# EAGLE board maho-dio (EAGLE 4.16)
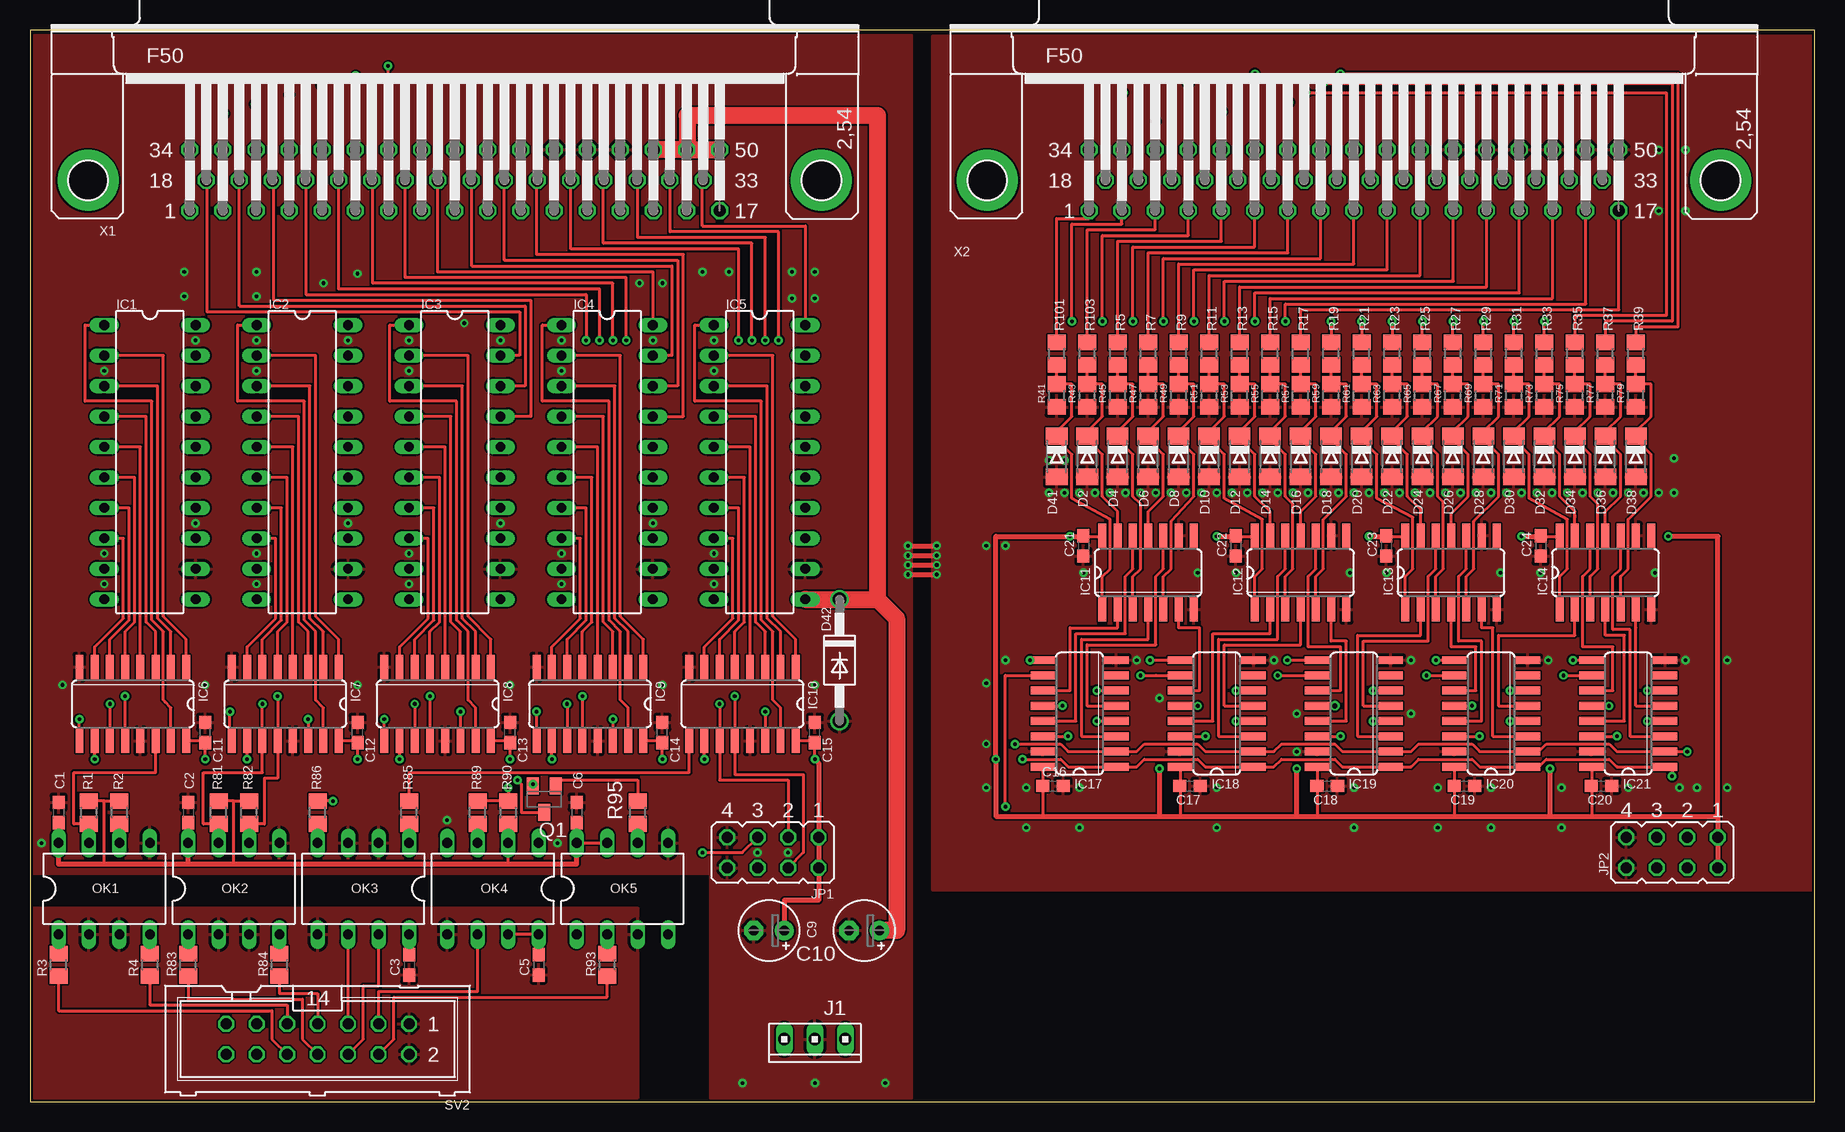
[diagram p2: board, top side]
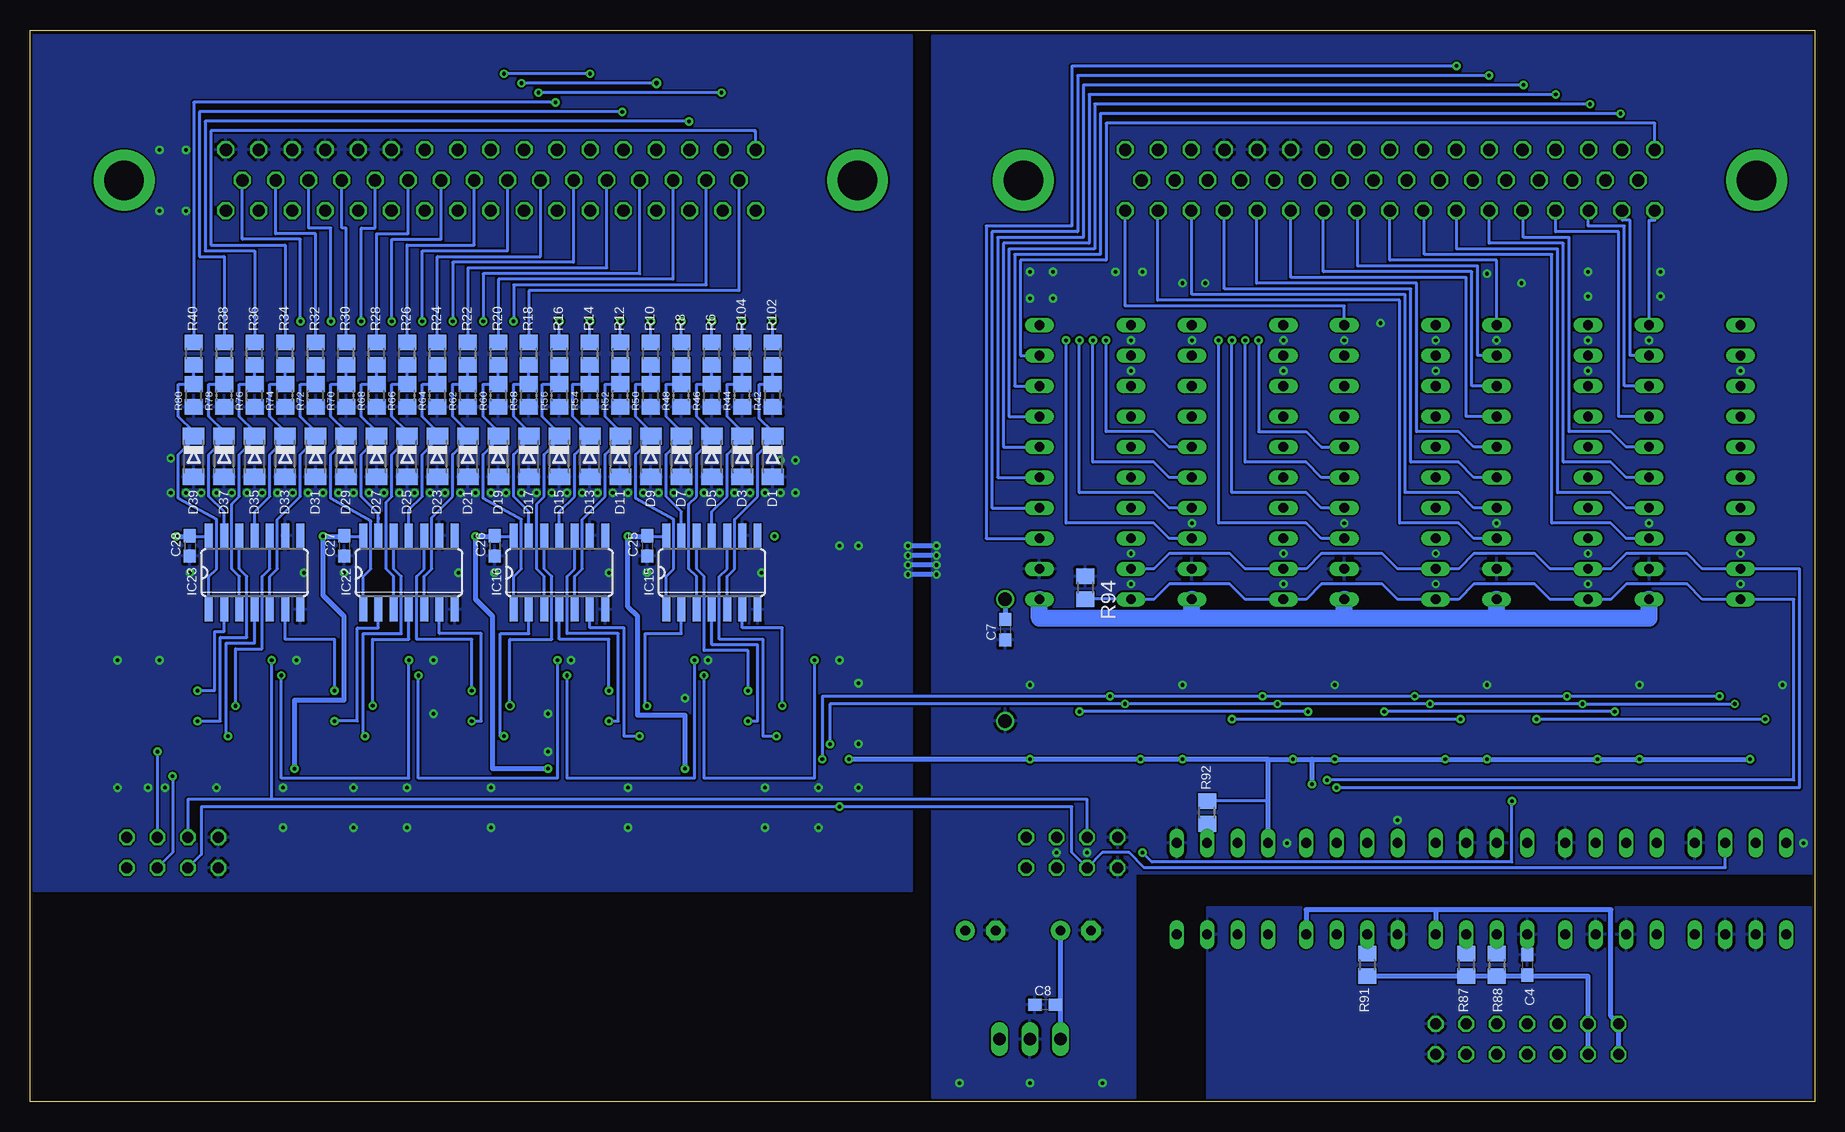
[diagram p3: board, bottom side, seen from below]

Size 148.73 x 89.36 mm. Coordinates in mm from the lower left corner, seen from the top.
Outline: 0,0 148.73,0 148.73,89.36 0,89.36 0,0
Copper layers (1+2*15+16): Top 0.035mm / dielectric 0.15mm / Route2 0.018mm / dielectric 1.5mm / Route15 0.018mm / dielectric 0.15mm / Bottom 0.035mm
Design rules "eurocircuits_class5": minimum track width 0.15mm, minimum drill 0.2mm, track to track 0.15mm, track to pad 0.15mm, pad to pad 0.15mm, via to via 0.15mm, smd to smd 0mil, copper to edge 0.2mm, drill to drill 0.2mm, minimum pad ring 0.2mm, minimum via ring 0.2mm, stop-mask expansion 4mil, vias tented up to drill 0mil, thermal gap 10mil

## Footprints (pad centres in the part's own frame; a part is rotated, then mirrored left to right if it is on the bottom)
C0603 = smd 1.1 x 1: 1 -0.85,0; 2 0.85,0
E2,5-5 = drill 0.813 pad 1.6 round: + -1.27,0 | drill 0.813 pad 1.6 octagon: - 1.27,0
MINIMELF = smd 1.4 x 1.8: A 1.7,0; C -1.7,0
DO41-10 = drill 1.118 round: A 5.08,0; C -5.08,0
DIL20 = drill 0.813 long: 1 -11.43,-3.81; 2 -8.89,-3.81; 3 -6.35,-3.81; 4 -3.81,-3.81; 5 -1.27,-3.81; 6 1.27,-3.81; 7 3.81,-3.81; 8 6.35,-3.81; 9 8.89,-3.81; 10 11.43,-3.81; 11 11.43,3.81; 12 8.89,3.81; 13 6.35,3.81; 14 3.81,3.81; 15 1.27,3.81; 16 -1.27,3.81; 17 -3.81,3.81; 18 -6.35,3.81; 19 -8.89,3.81; 20 -11.43,3.81
SO16 = smd 0.66 x 2.032: 1 -4.445,-3.073; 2 -3.175,-3.073; 3 -1.905,-3.073; 4 -0.635,-3.073; 5 0.635,-3.073; 6 1.905,-3.073; 7 3.175,-3.073; 8 4.445,-3.073; 9 4.445,3.073; 10 3.175,3.073; 11 1.905,3.073; 12 0.635,3.073; 13 -0.635,3.073; 14 -1.905,3.073; 15 -3.175,3.073; 16 -4.445,3.073
SO14 = smd 0.66 x 2.032: 1 -3.81,-3.073; 2 -2.54,-3.073; 3 -1.27,-3.073; 4 0,-3.073; 5 1.27,-3.073; 6 2.54,-3.073; 7 3.81,-3.073; 8 3.81,3.073; 9 2.54,3.073; 10 1.27,3.073; 11 0,3.073; 12 -1.27,3.073; 13 -2.54,3.073; 14 -3.81,3.073
10X03MTA = drill 1.016 long: 1 2.54,0; 2 0,0; 3 -2.54,0
JP4Q = drill 0.914 octagon: 1 -3.81,-1.27; 2 -3.81,1.27; 3 -1.27,-1.27; 4 -1.27,1.27; 5 1.27,-1.27; 6 1.27,1.27; 7 3.81,-1.27; 8 3.81,1.27
DIL08 = drill 0.813 long: 1 -3.81,-3.81; 2 -1.27,-3.81; 3 1.27,-3.81; 4 3.81,-3.81; 5 3.81,3.81; 6 1.27,3.81; 7 -1.27,3.81; 8 -3.81,3.81
SOT23-BEC = smd 1 x 1.4: B -0.95,-1.1; C 0,1.1; E 0.95,-1.1
R0805 = smd 1.3 x 1.5: 1 -0.95,0; 2 0.95,0
ML14 = drill 0.914 octagon: 1 -7.62,-1.27; 2 -7.62,1.27; 3 -5.08,-1.27; 4 -5.08,1.27; 5 -2.54,-1.27; 6 -2.54,1.27; 7 0,-1.27; 8 0,1.27; 9 2.54,-1.27; 10 2.54,1.27; 11 5.08,-1.27; 12 5.08,1.27; 13 7.62,-1.27; 14 7.62,1.27
F50HP = drill 1.016 octagon: 1 -22.073,-2.54; 2 -19.329,-2.54; 3 -16.561,-2.54; 4 -13.792,-2.54; 5 -11.049,-2.54; 6 -8.28,-2.54; 7 -5.512,-2.54; 8 -2.769,-2.54; 9 0,-2.54; 10 2.769,-2.54; 11 5.512,-2.54; 12 8.28,-2.54; 13 11.049,-2.54; 14 13.792,-2.54; 15 16.561,-2.54; 16 19.329,-2.54; 17 22.073,-2.54; 18 -20.701,0; 19 -17.958,0; 20 -15.189,0; 21 -12.421,0; 22 -9.677,0; 23 -6.909,0; 24 -4.14,0; 25 -1.397,0; 26 1.372,0; 27 4.14,0; 28 6.883,0; 29 9.652,0; 30 12.421,0; 31 15.189,0; 32 17.932,0; 33 20.701,0; 34 -22.073,2.54; 35 -19.329,2.54; 36 -16.561,2.54; 37 -13.792,2.54; 38 -11.049,2.54; 39 -8.28,2.54; 40 -5.512,2.54; 41 -2.769,2.54; 42 0,2.54; 43 2.769,2.54; 44 5.512,2.54; 45 8.28,2.54; 46 11.049,2.54; 47 13.792,2.54; 48 16.561,2.54; 49 19.329,2.54; 50 22.073,2.54 | drill 3.302 pad 5.08 round: G1 -30.556,0; G2 30.556,0

## Placement (x,y rotation side)
C1  100n  [C0603]  2.38,24.12 270 top
C2  100n  [C0603]  13.17,24.12 270 top
C3  100n  [C0603]  31.59,11.42 270 top
C4  100n  [C0603]  23.97,11.42 270 bottom
C5  100n  [C0603]  42.38,11.42 270 top
C6  100n  [C0603]  45.56,24.12 270 top
C7  100n  [C0603]  67.46,39.36 270 bottom
C8  100n  [C0603]  64.13,8.09 180 bottom
C9  4u7/50V  [E2,5-5]  61.59,14.28 180 top
C10  10u/50V  [E2,5-5]  69.53,14.28 180 top
C11  100n  [C0603]  14.6,30.79 90 top
C12  100n  [C0603]  27.3,30.79 90 top
C13  100n  [C0603]  40,30.79 90 top
C14  100n  [C0603]  52.7,30.79 90 top
C15  100n  [C0603]  65.4,30.79 90 top
C16  100n  [C0603]  85.24,26.35 0 top
C17  100n  [C0603]  96.67,26.35 0 top
C18  100n  [C0603]  108.1,26.35 0 top
C19  100n  [C0603]  119.53,26.35 0 top
C20  100n  [C0603]  130.96,26.35 0 top
C21  100n  [C0603]  87.78,46.35 270 top
C22  100n  [C0603]  100.48,46.35 270 top
C23  100n  [C0603]  113.03,46.35 270 top
C24  100n  [C0603]  125.88,46.35 270 top
C25  100n  [C0603]  97.31,46.35 270 bottom
C26  100n  [C0603]  110.01,46.35 270 bottom
C27  100n  [C0603]  122.55,46.35 270 bottom
C28  100n  [C0603]  135.41,46.35 270 bottom
D1  ZPD4.6  [MINIMELF]  86.83,53.81 270 bottom
D2  ZPD4.6  [MINIMELF]  88.1,53.81 270 top
D3  ZPD4.6  [MINIMELF]  89.37,53.81 270 bottom
D4  ZPD4.6  [MINIMELF]  90.64,53.81 270 top
D5  ZPD4.6  [MINIMELF]  91.91,53.81 270 bottom
D6  ZPD4.6  [MINIMELF]  93.18,53.81 270 top
D7  ZPD4.6  [MINIMELF]  94.45,53.81 270 bottom
D8  ZPD4.6  [MINIMELF]  95.72,53.81 270 top
D9  ZPD4.6  [MINIMELF]  96.99,53.81 270 bottom
D10  ZPD4.6  [MINIMELF]  98.26,53.81 270 top
D11  ZPD4.6  [MINIMELF]  99.53,53.81 270 bottom
D12  ZPD4.6  [MINIMELF]  100.8,53.81 270 top
D13  ZPD4.6  [MINIMELF]  102.07,53.81 270 bottom
D14  ZPD4.6  [MINIMELF]  103.34,53.81 270 top
D15  ZPD4.6  [MINIMELF]  104.61,53.81 270 bottom
D16  ZPD4.6  [MINIMELF]  105.88,53.81 270 top
D17  ZPD4.6  [MINIMELF]  107.15,53.81 270 bottom
D18  ZPD4.6  [MINIMELF]  108.42,53.81 270 top
D19  ZPD4.6  [MINIMELF]  109.69,53.81 270 bottom
D20  ZPD4.6  [MINIMELF]  110.96,53.81 270 top
D21  ZPD4.6  [MINIMELF]  112.23,53.81 270 bottom
D22  ZPD4.6  [MINIMELF]  113.5,53.81 270 top
D23  ZPD4.6  [MINIMELF]  114.77,53.81 270 bottom
D24  ZPD4.6  [MINIMELF]  116.04,53.81 270 top
D25  ZPD4.6  [MINIMELF]  117.31,53.81 270 bottom
D26  ZPD4.6  [MINIMELF]  118.58,53.81 270 top
D27  ZPD4.6  [MINIMELF]  119.85,53.81 270 bottom
D28  ZPD4.6  [MINIMELF]  121.12,53.81 270 top
D29  ZPD4.6  [MINIMELF]  122.39,53.81 270 bottom
D30  ZPD4.6  [MINIMELF]  123.66,53.81 270 top
D31  ZPD4.6  [MINIMELF]  124.93,53.81 270 bottom
D32  ZPD4.6  [MINIMELF]  126.2,53.81 270 top
D33  ZPD4.6  [MINIMELF]  127.47,53.81 270 bottom
D34  ZPD4.6  [MINIMELF]  128.74,53.81 270 top
D35  ZPD4.6  [MINIMELF]  130.01,53.81 270 bottom
D36  ZPD4.6  [MINIMELF]  131.28,53.81 270 top
D37  ZPD4.6  [MINIMELF]  132.55,53.81 270 bottom
D38  ZPD4.6  [MINIMELF]  133.82,53.81 270 top
D39  ZPD4.6  [MINIMELF]  135.09,53.81 270 bottom
D41  ZPD4.6  [MINIMELF]  85.56,53.81 270 top
D42  1N4004  [DO41-10]  67.46,36.82 270 top
IC1  UDN2987  [DIL20]  10,53.33 270 top
IC2  UDN2987  [DIL20]  22.7,53.33 270 top
IC3  UDN2987  [DIL20]  35.4,53.33 270 top
IC4  UDN2987  [DIL20]  48.1,53.33 270 top
IC5  UDN2987  [DIL20]  60.8,53.33 270 top
IC6  74HC595D  [SO16]  8.57,33.17 180 top
IC7  74HC595D  [SO16]  21.27,33.17 180 top
IC8  74HC595D  [SO16]  33.97,33.17 180 top
IC9  74HC595D  [SO16]  46.67,33.17 180 top
IC10  74HC595D  [SO16]  59.37,33.17 180 top
IC11  74HC14D  [SO14]  93.18,44.13 0 top
IC12  74HC14D  [SO14]  105.88,44.13 0 top
IC13  74HC14D  [SO14]  118.42,44.13 0 top
IC14  74HC14D  [SO14]  131.28,44.13 0 top
IC15  74HC14D  [SO14]  91.91,44.13 0 bottom
IC16  74HC14D  [SO14]  104.61,44.13 0 bottom
IC17  74HC165D  [SO16]  87.47,32.38 90 top
IC18  74HC165D  [SO16]  98.9,32.38 90 top
IC19  74HC165D  [SO16]  110.33,32.38 90 top
IC20  74HC165D  [SO16]  121.76,32.38 90 top
IC21  74HC165D  [SO16]  133.19,32.38 90 top
IC22  74HC14D  [SO14]  117.15,44.13 0 bottom
IC23  74HC14D  [SO14]  130.01,44.13 0 bottom
J1  [10X03MTA]  65.4,5.23 180 top
JP1  [JP4Q]  61.91,20.79 180 top
JP2  [JP4Q]  136.84,20.79 180 top
OK1  HCPL2630  [DIL08]  6.19,17.77 0 top
OK2  HCPL2630  [DIL08]  16.98,17.77 0 top
OK3  HCPL2630  [DIL08]  27.78,17.77 180 top
OK4  6N137  [DIL08]  38.57,17.77 180 top
OK5  6N137  [DIL08]  49.37,17.77 0 top
Q1  BC857ASMD  [SOT23-BEC]  42.86,25.23 180 top
R1  390R  [R0805]  4.92,24.12 90 top
R2  390R  [R0805]  7.46,24.12 90 top
R3  120R  [R0805]  2.38,11.42 90 top
R4  120R  [R0805]  10,11.42 90 top
R5  4k7  [R0805]  90.64,62.38 90 top
R6  4k7  [R0805]  91.91,62.38 90 bottom
R7  4k7  [R0805]  93.18,62.38 90 top
R8  4k7  [R0805]  94.45,62.38 90 bottom
R9  4k7  [R0805]  95.72,62.38 90 top
R10  4k7  [R0805]  96.99,62.38 90 bottom
R11  4k7  [R0805]  98.26,62.38 90 top
R12  4k7  [R0805]  99.53,62.38 90 bottom
R13  4k7  [R0805]  100.8,62.38 90 top
R14  4k7  [R0805]  102.07,62.38 90 bottom
R15  4k7  [R0805]  103.34,62.38 90 top
R16  4k7  [R0805]  104.61,62.38 90 bottom
R17  4k7  [R0805]  105.88,62.38 90 top
R18  4k7  [R0805]  107.15,62.38 90 bottom
R19  4k7  [R0805]  108.42,62.38 90 top
R20  4k7  [R0805]  109.69,62.38 90 bottom
R21  4k7  [R0805]  110.96,62.38 90 top
R22  4k7  [R0805]  112.23,62.38 90 bottom
R23  4k7  [R0805]  113.5,62.38 90 top
R24  4k7  [R0805]  114.77,62.38 90 bottom
R25  4k7  [R0805]  116.04,62.38 90 top
R26  4k7  [R0805]  117.31,62.38 90 bottom
R27  4k7  [R0805]  118.58,62.38 90 top
R28  4k7  [R0805]  119.85,62.38 90 bottom
R29  4k7  [R0805]  121.12,62.38 90 top
R30  4k7  [R0805]  122.39,62.38 90 bottom
R31  4k7  [R0805]  123.66,62.38 90 top
R32  4k7  [R0805]  124.93,62.38 90 bottom
R33  4k7  [R0805]  126.2,62.38 90 top
R34  4k7  [R0805]  127.47,62.38 90 bottom
R35  4k7  [R0805]  128.74,62.38 90 top
R36  4k7  [R0805]  130.01,62.38 90 bottom
R37  4k7  [R0805]  131.28,62.38 90 top
R38  4k7  [R0805]  132.55,62.38 90 bottom
R39  4k7  [R0805]  133.82,62.38 90 top
R40  4k7  [R0805]  135.09,62.38 90 bottom
R41  1k  [R0805]  85.56,58.89 90 top
R42  1k  [R0805]  86.83,58.89 90 bottom
R43  1k  [R0805]  88.1,58.89 90 top
R44  1k  [R0805]  89.37,58.89 90 bottom
R45  1k  [R0805]  90.64,58.89 90 top
R46  1k  [R0805]  91.91,58.89 90 bottom
R47  1k  [R0805]  93.18,58.89 90 top
R48  1k  [R0805]  94.45,58.89 90 bottom
R49  1k  [R0805]  95.72,58.89 90 top
R50  1k  [R0805]  96.99,58.89 90 bottom
R51  1k  [R0805]  98.26,58.89 90 top
R52  1k  [R0805]  99.53,58.89 90 bottom
R53  1k  [R0805]  100.8,58.89 90 top
R54  1k  [R0805]  102.07,58.89 90 bottom
R55  1k  [R0805]  103.34,58.89 90 top
R56  1k  [R0805]  104.61,58.89 90 bottom
R57  1k  [R0805]  105.88,58.89 90 top
R58  1k  [R0805]  107.15,58.89 90 bottom
R59  1k  [R0805]  108.42,58.89 90 top
R60  1k  [R0805]  109.69,58.89 90 bottom
R61  1k  [R0805]  110.96,58.89 90 top
R62  1k  [R0805]  112.23,58.89 90 bottom
R63  1k  [R0805]  113.5,58.89 90 top
R64  1k  [R0805]  114.77,58.89 90 bottom
R65  1k  [R0805]  116.04,58.89 90 top
R66  1k  [R0805]  117.31,58.89 90 bottom
R67  1k  [R0805]  118.58,58.89 90 top
R68  1k  [R0805]  119.85,58.89 90 bottom
R69  1k  [R0805]  121.12,58.89 90 top
R70  1k  [R0805]  122.39,58.89 90 bottom
R71  1k  [R0805]  123.66,58.89 90 top
R72  1k  [R0805]  124.93,58.89 90 bottom
R73  1k  [R0805]  126.2,58.89 90 top
R74  1k  [R0805]  127.47,58.89 90 bottom
R75  1k  [R0805]  128.74,58.89 90 top
R76  1k  [R0805]  130.01,58.89 90 bottom
R77  1k  [R0805]  131.28,58.89 90 top
R78  1k  [R0805]  132.55,58.89 90 bottom
R79  1k  [R0805]  133.82,58.89 90 top
R80  1k  [R0805]  135.09,58.89 90 bottom
R81  390R  [R0805]  15.71,24.12 90 top
R82  390R  [R0805]  18.25,24.12 90 top
R83  120R  [R0805]  13.17,11.42 90 top
R84  120R  [R0805]  20.79,11.42 90 top
R85  220R  [R0805]  31.59,24.12 90 top
R86  220R  [R0805]  23.97,24.12 90 top
R87  270R  [R0805]  29.05,11.42 270 bottom
R88  270R  [R0805]  26.51,11.42 270 bottom
R89  220R  [R0805]  37.3,24.12 90 top
R90  1k  [R0805]  39.84,24.12 270 top
R91  270R  [R0805]  37.3,11.42 270 bottom
R92  4k7  [R0805]  50.64,24.12 90 bottom
R93  120R  [R0805]  48.1,11.42 90 top
R94  4k7  [R0805]  60.8,42.86 270 bottom
R95  4k7  [R0805]  50.64,24.12 90 top
R101  4k7  [R0805]  85.56,62.38 90 top
R102  4k7  [R0805]  86.83,62.38 90 bottom
R103  4k7  [R0805]  88.1,62.38 90 top
R104  4k7  [R0805]  89.37,62.38 90 bottom
SV2  [ML14]  23.97,5.23 180 top
X1  [F50HP]  35.4,76.83 0 top
X2  [F50HP]  110.33,76.83 0 top

## Tracks (layer width: path | path; a pad name or v marks a point on that pad's centre or on a via)
+3V3
  Bottom 0.254: 23.97,10.47 C4.2 | R88.2 | R91.2 | R87.2 | SV2.11
  Bottom 0.406: SV2.12 | SV2.12 SV2.11 18.89,10.47 23.97,10.47 R88.2 R87.2 R91.2
+5V  (via drill 0.3)
  Top 0.254: OK1.8 | OK1.8 | OK1.8 C1.2 2.38,23.33 | R2.2 6.19,25.08 | R1.2 6.19,25.08 | 13.17,23.33 C2.2 | OK2.8 13.17,23.33 | 13.17,23.33 | OK4.2 | OK4.2 R90.2 | OK5.8 C6.2 | OK5.8 | OK5.8 OK5.7 | 39.84,19.84 OK4.2 | 6.19,19.84 6.19,25.08 | 16.98,25.07 R81.2 | 16.98,19.84 16.98,25.07 | 16.98,25.07 | 16.98,25.07 R82.2 | 16.98,25.07 16.98,25.08 | IC6.10 v5.39,28.57 | v18.09,28.57 IC7.10 | v30.79,28.57 IC8.10 | v40,28.57 40,29.84 | v43.49,28.57 IC9.10 | IC10.10 | v56.19,28.57 IC10.10 | v65.4,28.57 65.4,29.84 | v52.7,28.57 C14.1 52.7,30.1 IC9.16 | v27.3,28.57 27.3,29.84 | v14.6,28.57 C11.1 | C11.1 | IC6.16 14.6,30.1 C11.1 | 27.3,29.84 C12.1 | C12.1 | IC7.16 27.3,30.1 27.3,29.84 | 40,29.84 C13.1 | IC8.16 40,30.1 40,29.84 | 65.4,29.84 C15.1 | IC10.16 65.4,30.1 65.4,29.84 | C21.1 87.78,47.14 89.37,47.14 IC11.14 | 100.48,47.14 | 100.48,47.14 C22.1 | IC12.14 102.07,47.14 100.48,47.14 | 113.02,47.14 | 113.02,47.14 C23.1 | IC13.14 114.61,47.14 113.02,47.14 | C24.1 125.88,47.14 127.47,47.14 IC14.14 | IC17.16 84.45,27.93 84.45,26.35 | 84.45,26.35 C16.1 | 84.45,23.81 84.45,26.35 | 95.88,23.81 95.88,26.35 | 107.31,23.81 107.31,26.35 | 118.74,23.81 118.74,26.35 | 130.17,23.81 130.17,26.35 | IC21.16 130.17,27.93 130.17,26.35 | 130.17,26.35 C20.1 | IC20.16 118.74,27.93 118.74,26.35 | 118.74,26.35 C19.1 | IC19.16 107.31,27.93 107.31,26.35 | 107.31,26.35 C18.1 | 95.88,27.93 | 95.88,27.93 IC18.16 | 95.88,26.35 C17.1 | 95.88,26.35 95.88,27.93 | OK2.8 | OK5.7 | v41.91,26.5 | Q1.E v41.91,26.5
  Top 0.406: OK1.8 2.38,19.84 6.19,19.84 13.17,19.84 | 13.17,19.84 OK2.8 | 13.17,19.84 16.98,19.84 39.84,19.84 45.56,19.84 OK5.8 | v98.9,47.14 100.48,47.14 | v111.6,47.14 113.02,47.14 | v124.3,47.14 125.88,47.14 | v86.67,47.14 87.78,47.14 | v86.67,47.14 | v86.67,47.14 80.48,47.14 v80.48,28.57 80.48,23.81 84.45,23.81 94.13,23.81 | v136.52,47.14 140.65,47.14 140.65,23.81 | 94.13,23.81 95.88,23.81 105.56,23.81 | 105.56,23.81 107.31,23.81 118.74,23.81 126.68,23.81 | 126.68,23.81 130.17,23.81 140.65,23.81 | 94.13,23.81 v94.13,27.77 | 105.56,23.81 v105.56,27.77 | 126.68,23.81 v126.68,27.77 | 140.65,23.81 | 140.65,23.81 JP2.1 JP2.2 | JP1.1 JP1.2 | v65.4,28.57 65.72,28.25 JP1.1 | JP1.1 | JP1.2 | JP1.2 65.72,16.82 62.86,16.82 C9.+ | C9.+
  Bottom 0.254: IC15.14 95.72,47.14 97.31,47.14 | IC16.14 108.42,47.14 110.01,47.14 | IC22.14 120.96,47.14 122.55,47.14 | IC23.14 133.82,47.14 135.41,47.14 | R92.2 45.56,25.08
  Bottom 0.406: v5.39,28.57 v14.6,28.57 v18.09,28.57 v27.3,28.57 v30.79,28.57 v40,28.57 41.91,28.57 | 41.91,28.57 v43.49,28.57 45.56,28.57 | 45.56,28.57 v52.7,28.57 v56.19,28.57 v65.4,28.57 v80.48,28.57 | C25.1 97.31,47.14 v98.9,47.14 98.9,41.27 98.1,40.48 98.1,32.22 94.13,32.22 v94.13,27.77 | C26.1 110.01,47.14 v111.6,47.14 111.6,41.9 110.17,40.48 110.17,27.77 v105.56,27.77 | C27.1 122.55,47.14 v124.3,47.14 124.3,42.22 122.55,40.48 122.55,33.49 126.68,33.49 v126.68,27.77 | C28.1 135.41,47.14 v136.52,47.14 | 41.91,28.57 | 41.91,28.57 v41.91,26.5 | OK5.8 | OK5.8 45.56,25.08 45.56,28.57 | 45.56,28.57 | J1.1 | C9.+ 62.86,13.01 62.86,8.09 | 62.86,8.09 J1.1 | C8.1 | 62.86,8.09 C8.1 | JP1.2
+12V
  Top 0.254: OK3.8 | OK3.8 | OK3.8 C3.1 | OK4.8 C5.1 | OK4.8 | OK4.8 OK4.7
  Bottom 0.254: SV2.14 | OK4.8 | OK3.8
  Bottom 0.406: SV2.14 SV2.13 16.98,7.14 16.98,16.03 31.59,16.03 | 31.59,16.03 42.38,16.03 OK4.8 | 31.59,16.03 OK3.8
+24V
  Top 1.422: X1.48 X1.49 54.76,79.37 | 54.76,79.37 X1.50 | 54.76,79.37 54.76,82.23 70.64,82.23 70.64,41.9 | 70.64,41.9 72.23,40.32 72.23,14.28 | D42.C | D42.C 70.64,41.9 | IC5.11 D42.C | 72.23,14.28 | 72.23,14.28 | 72.23,14.28 C10.+ | 72.23,14.28
  Bottom 0.406: D42.C | D42.C | C7.1 | D42.C C7.1
  Bottom 1.422: IC1.11 13.81,40.32 26.51,40.32 | 26.51,40.32 39.21,40.32 | 39.21,40.32 51.91,40.32 | 51.91,40.32 64.61,40.32 IC5.11 | 51.91,40.32 IC4.11 | 39.21,40.32 IC3.11 | 26.51,40.32 IC2.11
FAULT_OUT  (via drill 0.3)
  Top 0.254: R90.1 | R89.2 R90.1 | v39.84,26.19 R90.1
  Bottom 0.254: IC5.9 55.08,44.44 53.81,45.71 48.73,45.71 47.46,44.44 IC4.9 42.38,44.44 41.11,45.71 36.03,45.71 34.76,44.44 IC3.9 29.68,44.44 28.41,45.71 23.33,45.71 22.06,44.44 IC2.9 16.98,44.44 15.71,45.71 10.63,45.71 9.36,44.44 IC1.9 1.27,44.44 1.27,26.19 v39.84,26.19
FAULT_OUTI
  Top 0.254: OK4.6 | SV2.3 | SV2.3 29.05,9.2 37.3,9.2 OK4.6 | OK4.6
  Bottom 0.254: OK4.6 R91.1 | OK4.6
GND  (via drill 0.3)
  Top 0.254: IC17.8 90.38,36.66 | C2.1 13.17,24.92 | IC6.13
  Top 0.406: v73.18,46.35 v75.56,46.35 | v73.18,45.55 v75.56,45.55 | v73.18,44.76 v75.56,44.76 | v73.18,43.97 v75.56,43.97
  Bottom 0.406: v73.18,46.35 v75.56,46.35 | v73.18,45.55 v75.56,45.55 | v73.18,44.76 v75.56,44.76 | v73.18,43.97 v75.56,43.97
  other vias: 87.47,50.79 86.2,50.79 84.93,50.79 88.74,50.79 90.01,50.79 91.28,50.79 92.55,50.79 93.82,50.79 95.09,50.79 96.36,50.79 97.63,50.79 98.9,50.79 100.17,50.79 101.44,50.79 102.71,50.79 103.98,50.79 105.25,50.79 106.52,50.79 107.79,50.79 109.06,50.79 110.33,50.79 111.6,50.79 112.87,50.79 114.14,50.79 115.41,50.79 116.68,50.79 117.95,50.79 119.22,50.79 120.49,50.79 121.76,50.79 123.03,50.79 124.3,50.79 125.57,50.79 126.84,50.79 128.11,50.79 129.38,50.79 130.65,50.79 131.92,50.79 133.19,50.79 134.46,50.79 135.73,50.79 137,50.79 92.23,36.82 103.66,36.82 115.09,36.82 126.52,36.82 87.47,26.19 98.9,26.19 110.33,26.19 121.76,26.19 133.19,26.19 97.31,44.13 110.01,44.13 122.55,44.13 135.41,44.13 87.78,44.13 100.48,44.13 113.02,44.13 125.88,44.13 105.56,32.38 94.13,33.65 115.09,32.38 127.63,26.19 117.31,26.19 83.02,26.19 105.56,29.2 87.47,22.85 83.02,22.85 98.9,22.85 110.33,22.85 117.31,22.85 121.76,22.85 127.63,22.85 137.47,26.19 138.9,26.19 137.95,36.82 65.4,1.58 71.27,1.58 59.37,1.58 60.64,20.79 63.18,20.79 52.7,34.76 40,34.76 65.4,34.76 27.3,34.76 14.6,34.76 2.69,34.76 65.4,69.21 65.4,66.99 63.49,66.99 63.49,69.21 58.26,69.21 56.03,69.21 50.79,68.26 52.7,68.26 36.19,64.92 39.21,63.49 31.59,63.49 26.51,63.49 18.89,63.49 13.81,63.49 27.3,69.05 24.44,68.26 18.89,67.15 12.85,67.15 18.89,69.21 12.85,69.21 44.29,63.49 51.91,63.49 56.99,63.49 51.91,48.25 56.99,45.71 44.29,45.71 39.21,48.25 31.59,45.71 26.51,48.25 18.89,45.71 13.81,48.25 6.19,45.71 6.19,43.17 18.89,43.17 31.59,43.17 44.29,43.17 56.99,43.17 43.97,21.58 34.76,23.49 0.95,21.58 137,53.65 84.93,53.49 86.2,53.49 135.73,79.37 135.73,74.29 137.95,79.37 137.95,74.29 141.44,36.82 141.44,26.19 79.69,26.19 79.69,29.84 79.69,34.92 81.27,36.82 81.27,46.35 79.69,46.35 44.29,60.95 56.99,60.95 31.59,60.95 18.89,60.95 6.19,60.95
  pour Bottom: 75.24,88.89 148.43,88.89 148.43,17.61 75.24,17.61
  pour Top: 75.24,88.89 148.43,88.89 148.43,17.61 75.24,17.61
  pour Top: 0.31,88.89 0.31,19.04 56.67,19.04 56.67,12.06 56.67,9.68 56.67,0.31 73.5,0.31 73.5,88.89
  pour Bottom: 0.31,88.89 0.31,19.04 56.67,19.04 56.67,12.06 56.67,9.68 56.67,0.31 73.5,0.31 73.5,88.89
GNDI
  Top 0.254: OK3.5 | OK3.5 | OK3.5
  Bottom 0.254: C4.1 OK3.5
  pour Top: 0.31,16.19 50.64,16.19 50.64,12.22 50.64,10.79 50.64,0.31 0.31,0.31
  pour Bottom: 0.31,16.19 50.64,16.19 50.64,12.22 50.64,10.79 50.64,0.31 0.31,0.31
IN1
  Top 0.254: X2.1 88.25,73.65 85.56,73.65 R101.2
IN2  (via drill 0.3)
  Top 0.254: X2.2 91,73.18 86.83,73.18 v86.83,65.08
  Bottom 0.254: R102.2 v86.83,65.08
IN3
  Top 0.254: X2.3 93.77,72.7 88.1,72.7 R103.2
IN4  (via drill 0.3)
  Top 0.254: X2.4 96.53,72.22 89.37,72.22 v89.37,65.08
  Bottom 0.254: R104.2 v89.37,65.08
IN5
  Top 0.254: X2.5 99.28,71.75 90.64,71.75 R5.2
IN6  (via drill 0.3)
  Top 0.254: X2.6 102.05,71.27 91.91,71.27 v91.91,65.08
  Bottom 0.254: R6.2 v91.91,65.08
IN7
  Top 0.254: X2.7 104.81,70.8 93.18,70.8 R7.2
IN8  (via drill 0.3)
  Top 0.254: X2.8 107.56,70.32 94.45,70.32 v94.45,65.08
  Bottom 0.254: R8.2 v94.45,65.08
IN9
  Top 0.254: X2.9 110.33,69.84 95.72,69.84 R9.2
IN10  (via drill 0.3)
  Top 0.254: X2.10 113.09,69.37 96.99,69.37 v96.99,65.08
  Bottom 0.254: R10.2 v96.99,65.08
IN11
  Top 0.254: X2.11 115.84,68.89 98.26,68.89 R11.2
IN12  (via drill 0.3)
  Top 0.254: X2.12 118.61,68.41 99.53,68.41 v99.53,65.08
  Bottom 0.254: R12.2 v99.53,65.08
IN13
  Top 0.254: X2.13 121.38,67.94 100.8,67.94 R13.2
IN14  (via drill 0.3)
  Top 0.254: X2.14 124.12,67.46 102.07,67.46 v102.07,65.08
  Bottom 0.254: R14.2 v102.07,65.08
IN15
  Top 0.254: X2.15 126.89,66.99 103.34,66.99 R15.2
IN16  (via drill 0.3)
  Top 0.254: X2.16 129.66,66.51 104.61,66.51 v104.61,65.08
  Bottom 0.254: R16.2 v104.61,65.08
IN17
  Top 0.254: X2.17 132.4,66.03 105.88,66.03 R17.2
IN18
  Bottom 0.254: X2.18 89.62,67.62 107.15,67.62 R18.2
IN19  (via drill 0.3)
  Top 0.254: v108.42,65.08 R19.2
  Bottom 0.254: X2.19 92.37,68.1 108.42,68.1 v108.42,65.08
IN20
  Bottom 0.254: X2.20 95.14,68.57 109.69,68.57 R20.2
IN21  (via drill 0.3)
  Top 0.254: v110.96,65.08 R21.2
  Bottom 0.254: X2.21 97.91,69.05 110.96,69.05 v110.96,65.08
IN22
  Bottom 0.254: X2.22 100.65,69.53 112.23,69.53 R22.2
IN23  (via drill 0.3)
  Top 0.254: v113.5,65.08 R23.2
  Bottom 0.254: X2.23 103.42,70 113.5,70 v113.5,65.08
IN24
  Bottom 0.254: X2.24 106.19,70.48 114.77,70.48 R24.2
IN25  (via drill 0.3)
  Top 0.254: R25.2 v116.04,65.08
  Bottom 0.254: X2.25 108.93,70.95 116.04,70.95 v116.04,65.08
IN26
  Bottom 0.254: X2.26 111.7,71.43 117.31,71.43 R26.2
IN27  (via drill 0.3)
  Top 0.254: R27.2 v118.58,65.08
  Bottom 0.254: X2.27 114.47,71.91 118.58,71.91 v118.58,65.08
IN28
  Bottom 0.254: X2.28 117.21,72.38 119.85,72.38 R28.2
IN29  (via drill 0.3)
  Top 0.254: R29.2 v121.12,65.08
  Bottom 0.254: X2.29 119.98,72.86 121.12,72.86 v121.12,65.08
IN30
  Bottom 0.254: X2.30 122.75,72.86 122.39,72.86 R30.2
IN31  (via drill 0.3)
  Top 0.254: R31.2 v123.66,65.08
  Bottom 0.254: X2.31 125.52,72.86 123.66,72.86 v123.66,65.08
IN32
  Bottom 0.254: X2.32 128.26,72.38 124.93,72.38 R32.2
IN33  (via drill 0.3)
  Top 0.254: R33.2 v126.2,65.08
  Bottom 0.254: X2.33 131.03,71.91 126.2,71.91 v126.2,65.08
IN34
  Bottom 0.254: R34.2 127.47,71.43 133.66,71.43 133.66,80.96 88.42,80.96 | 88.42,80.96 | X2.34 88.25,80.96 88.42,80.96
IN35  (via drill 0.3)
  Top 0.254: R35.2 128.74,65.56 136.36,65.56 136.36,84.13 v106.36,84.13 | X2.35 91.12,79.49 v91.12,84.13
  Bottom 0.254: v91.12,84.13 v106.36,84.13
IN36  (via drill 0.3)
  Top 0.254: v93.82,81.75 | X2.36 93.82,79.42 v93.82,81.75
  Bottom 0.254: R36.2 130.01,70.95 134.14,70.95 134.14,81.75 v93.82,81.75
IN37  (via drill 0.3, 0.4)
  Top 0.254: R37.2 131.28,65.08 136.84,65.08 136.84,84.92 v107.79,84.92 | X2.37 96.52,79.39 v96.52,84.92
  Bottom 0.254: v107.79,84.92 | v96.52,84.92 v107.79,84.92
IN38  (via drill 0.3)
  Top 0.254: X2.38 99.37,79.46 v99.37,82.54
  Bottom 0.254: R38.2 132.55,70.48 134.62,70.48 134.62,82.54 v99.37,82.54
IN39  (via drill 0.3)
  Top 0.254: R39.2 133.82,64.61 137.31,64.61 137.31,85.72 v109.21,85.72 | X2.39 102.07,79.39 v102.07,85.72
  Bottom 0.254: v109.21,85.72 | v102.07,85.72 v109.21,85.72
IN40  (via drill 0.3)
  Top 0.254: v104.93,83.34 | X2.40 104.93,79.48 v104.93,83.34
  Bottom 0.254: 135.09,83.34 R40.2 | 135.09,83.34 | v104.93,83.34 135.09,83.34
N$1
  Top 0.254: IC1.1 4.6,64.76 4.6,58.41 10.16,58.41 10.16,40.16 11.11,39.2 11.11,33.49 11.27,33.33 | IC6.15 11.74,32.85 11.27,33.33 | 11.27,33.33
N$2
  Top 0.254: IC1.2 11.11,62.22 11.11,40.48 | 11.11,40.48 | IC6.1 13.01,38.57 11.11,40.48
N$3
  Top 0.254: IC1.3 10.63,59.68 10.63,40.32 11.74,39.2 IC6.2
N$4
  Top 0.254: IC1.4 9.68,57.14 9.68,40 10.47,39.2 IC6.3
N$5
  Top 0.254: IC1.5 9.2,54.6 IC6.4 | IC6.4
N$6
  Top 0.254: IC1.6 8.73,52.06 8.73,40 7.93,39.2 IC6.5
N$7
  Top 0.254: IC1.7 8.25,49.52 8.25,40.16 6.66,38.57 IC6.6
N$8
  Top 0.254: IC1.8 7.77,46.98 7.77,40.32 5.39,37.94 IC6.7
N$9
  Top 0.254: IC2.1 17.3,64.76 17.3,58.41 22.86,58.41 22.86,40.16 23.81,39.2 23.81,33.49 24.44,32.85 IC7.15
N$10
  Top 0.254: IC2.2 23.81,62.22 23.81,40.48 25.71,38.57 IC7.1
N$11
  Top 0.254: IC2.3 23.33,59.68 23.33,40.32 24.44,39.2 IC7.2
N$12
  Top 0.254: IC2.4 22.38,57.14 22.38,40 23.17,39.2 IC7.3
N$13
  Top 0.254: IC2.5 21.9,54.6 IC7.4
N$14
  Top 0.254: IC2.6 21.43,52.06 21.43,40 20.63,39.2 IC7.5
N$15
  Top 0.254: IC2.7 20.95,49.52 20.95,40.16 19.36,38.57 IC7.6
N$16
  Top 0.254: IC2.8 20.47,46.98 20.47,40.32 18.09,37.94 IC7.7
N$17
  Top 0.254: IC3.1 30,64.76 30,58.41 35.55,58.41 35.55,40.16 36.51,39.2 36.51,33.49 37.14,32.85 IC8.15
N$18
  Top 0.254: IC3.2 36.51,62.22 36.51,40.48 38.41,38.57 IC8.1
N$19
  Top 0.254: IC3.3 36.03,59.68 36.03,40.32 37.14,39.2 IC8.2
N$20
  Top 0.254: IC3.4 35.08,57.14 35.08,40 35.87,39.2 IC8.3
N$21
  Top 0.254: IC3.5 34.6,54.6 IC8.4
N$22
  Top 0.254: IC3.6 34.13,52.06 34.13,40 33.33,39.2 IC8.5
N$23
  Top 0.254: IC3.7 33.65,49.52 33.65,40.16 32.06,38.57 IC8.6
N$24
  Top 0.254: IC3.8 33.17,46.98 33.17,40.32 30.79,37.94 IC8.7
N$25
  Top 0.254: IC4.1 42.7,64.76 42.7,58.41 48.26,58.41 48.26,40.16 49.21,39.2 49.21,33.49 49.84,32.85 IC9.15
N$26
  Top 0.254: IC4.2 49.21,62.22 49.21,40.48 51.11,38.57 IC9.1
N$27
  Top 0.254: IC4.3 48.73,59.68 48.73,40.32 49.84,39.2 IC9.2
N$28
  Top 0.254: IC4.4 47.78,57.14 47.78,40 48.57,39.2 IC9.3
N$29
  Top 0.254: IC4.5 47.3,54.6 IC9.4
N$30
  Top 0.254: IC4.6 46.83,52.06 46.83,40 46.03,39.2 IC9.5
N$31
  Top 0.254: IC4.7 46.35,49.52 46.35,40.16 44.76,38.57 IC9.6
N$32
  Top 0.254: IC4.8 45.87,46.98 45.87,40.32 43.49,37.94 IC9.7
N$33
  Top 0.254: IC5.1 55.4,64.76 55.4,58.41 60.96,58.41 60.96,40.16 61.91,39.2 61.91,33.49 62.54,32.85 IC10.15
N$34
  Top 0.254: IC5.2 61.91,62.22 61.91,40.48 63.81,38.57 IC10.1
N$35
  Top 0.254: IC5.3 61.43,59.68 61.43,40.32 62.54,39.2 IC10.2
N$36
  Top 0.254: IC5.4 60.48,57.14 60.48,40 61.27,39.2 IC10.3
N$37
  Top 0.254: IC5.5 60,54.6 IC10.4
N$38
  Top 0.254: IC5.6 59.53,52.06 59.53,40 58.73,39.2 IC10.5
N$39
  Top 0.254: IC5.7 59.05,49.52 59.05,40.16 57.46,38.57 IC10.6
N$40
  Top 0.254: IC5.8 58.57,46.98 58.57,40.32 56.19,37.94 IC10.7
N$41
  Top 0.254: OK3.1 | OK3.1 | R85.1 OK3.1
N$42
  Top 0.254: OK3.4 | OK3.4 | R86.1 OK3.4 | OK3.4
N$43  (via drill 0.3)
  Top 0.254: IC6.9 v4.12,31.9 | v23.17,31.9 IC7.14
  Bottom 0.254: v4.12,31.9 v23.17,31.9
N$44  (via drill 0.3)
  Top 0.254: IC7.9 16.66,30.1 v16.66,32.54 | v35.87,32.54 IC8.14
  Bottom 0.254: v16.66,32.54 v35.87,32.54
N$45  (via drill 0.3)
  Top 0.254: IC8.9 v29.52,31.9 | 48.57,30 IC9.14 v48.57,31.9
  Bottom 0.254: v29.52,31.9 v48.57,31.9
N$46  (via drill 0.3)
  Top 0.254: IC9.9 v42.22,32.54 | IC10.14 61.27,30 | IC10.14 | v61.27,32.54 IC10.14
  Bottom 0.254: v42.22,32.54 v61.27,32.54
N$47
  Top 0.254: OK1.1 | R3.2 OK1.1
N$48
  Top 0.254: OK1.4 | R4.2 OK1.4
N$49
  Top 0.254: OK2.1 | R83.2 OK2.1
N$50
  Top 0.254: IC11.1 89.37,43.81 90.01,44.44 90.01,48.57 86.83,50.32 86.83,53.97 85.56,55.24 D41.C 85.56,55.87 86.83,57.14 86.83,59.84 R41.2 R101.1
N$51
  Bottom 0.254: R102.1 R42.2 87.94,59.84 87.94,56.98 86.83,55.87 D1.C 86.83,55.24 88.1,53.97 88.1,50.48 90.01,48.57 90.01,44.44 90.64,43.81 IC15.5 | IC15.5
N$52
  Top 0.254: IC11.13 90.64,49.21 89.37,50.48 89.37,53.97 88.1,55.24 D2.C 88.1,55.87 89.37,57.14 89.37,59.84 | 89.37,59.84 R43.2 R103.1 | 89.37,59.84
N$53
  Bottom 0.254: R104.1 R44.2 90.64,59.84 90.64,57.14 89.37,55.87 D3.C 89.37,55.24 90.64,53.97 90.64,50.48 91.91,49.21 IC15.11 | IC15.11
N$54
  Top 0.254: IC11.3 91.91,43.81 92.55,44.44 92.55,49.84 91.91,50.48 91.91,53.97 90.64,55.24 D4.C 90.64,55.87 91.91,57.14 91.91,59.84 | 91.91,59.84 R45.2 R5.1 | 91.91,59.84
N$55
  Bottom 0.254: R6.1 R46.2 93.18,59.84 93.18,57.14 91.91,55.87 D5.C 91.91,55.24 93.18,53.97 93.18,50.48 93.82,49.84 93.82,44.44 93.18,43.81 IC15.3 | IC15.3
N$56
  Top 0.254: IC11.11 93.18,49.21 94.45,50.48 94.45,53.97 93.18,55.24 D6.C 93.18,55.87 94.45,57.14 94.45,59.84 | 94.45,59.84 R47.2 R7.1 | 94.45,59.84
N$57
  Bottom 0.254: R8.1 R48.2 95.72,59.84 95.72,57.14 94.45,55.87 D7.C 94.45,55.24 95.72,53.97 95.72,50.48 94.45,49.21 IC15.13 | IC15.13
N$58
  Top 0.254: IC11.2 90.64,39.52 86.67,39.52 86.67,34.28 86.04,34.28 IC17.11
N$59  (via drill 0.3)
  Top 0.254: IC17.12 v86.04,33.01 | v86.04,33.01
  Bottom 0.254: IC15.6 | IC15.6 89.37,39.52 86.04,39.52 v86.04,33.01
N$60
  Top 0.254: IC11.12 91.91,44.44 91.28,43.81 91.28,39.05 87.15,39.05 87.15,31.74 IC17.13
N$61  (via drill 0.3)
  Top 0.254: IC17.14 84.45,30.47 v86.51,30.47
  Bottom 0.254: IC15.10 90.64,44.44 91.28,43.81 91.28,38.57 87.62,38.57 87.62,30.47 v86.51,30.47
N$62
  Top 0.254: IC11.4 93.18,38.57 87.62,38.57 87.62,30.47 | 87.62,30.47 | 87.62,30.47 IC17.3 | 87.62,30.47
N$63  (via drill 0.3)
  Top 0.254: v88.89,31.74 IC17.4 | v88.89,31.74
  Bottom 0.254: IC15.4 | IC15.4 91.91,38.09 88.1,38.09 88.1,31.74 v88.89,31.74 | v88.89,31.74
N$64
  Top 0.254: IC11.10 94.45,44.44 93.82,43.81 93.82,38.09 88.1,38.09 88.1,33.01 IC17.5
N$65  (via drill 0.3)
  Top 0.254: v88.89,34.28 | v88.89,34.28 IC17.6 | v88.89,34.28
  Bottom 0.254: IC15.12 | IC15.12 93.18,44.44 92.55,43.81 92.55,37.62 88.89,37.62 v88.89,34.28 | v88.89,34.28
N$66
  Top 0.254: IC11.5 94.45,43.81 95.09,44.44 95.09,48.41 96.99,50.48 96.99,53.97 95.72,55.24 D8.C 95.72,55.87 96.99,57.14 96.99,59.84 | 96.99,59.84 R49.2 R9.1 | 96.99,59.84
N$67
  Bottom 0.254: R10.1 R50.2 98.26,59.84 98.26,57.14 96.99,55.87 D9.C 96.99,55.24 98.26,53.97 98.26,50.32 95.09,48.57 95.09,44.44 95.72,43.81 IC15.1 | IC15.1
N$68
  Top 0.254: 99.53,59.84 R51.2 R11.1 | 99.53,59.84 | 99.53,59.84 99.53,57.14 98.26,55.87 D10.C 98.26,55.24 99.53,53.97 99.53,50.32 102.71,48.57 102.71,44.44 102.07,43.81 IC12.1
N$69
  Bottom 0.254: R12.1 R52.2 100.8,59.84 100.8,57.14 99.53,55.87 D11.C 99.53,55.24 100.8,53.97 100.8,50.48 102.71,48.57 102.71,44.44 103.34,43.81 IC16.5 | IC16.5
N$70
  Top 0.254: 102.07,59.84 R53.2 R13.1 | 102.07,59.84 | 102.07,59.84 102.07,57.14 100.8,55.87 D12.C 100.8,55.24 102.07,53.97 102.07,50.48 103.34,49.21 IC12.13 | IC12.13
N$71
  Bottom 0.254: R14.1 R54.2 103.5,59.84 103.5,57.14 102.07,55.71 D13.C 102.07,55.24 103.34,53.97 103.34,50.48 104.61,49.21 IC16.11 | IC16.11
N$72
  Top 0.254: 104.61,59.84 R55.2 R15.1 | 104.61,59.84 | 104.61,59.84 104.61,57.14 103.34,55.87 D14.C 103.34,55.24 104.61,53.97 104.61,50.48 105.25,49.84 105.25,44.44 104.61,43.81 IC12.3
N$73
  Bottom 0.254: R16.1 R56.2 106.04,59.84 106.04,57.14 104.61,55.71 D15.C 104.61,55.24 105.88,53.97 105.88,50.48 106.52,49.84 106.52,44.44 105.88,43.81 | IC16.3 105.88,43.81 | 105.88,43.81
N$74
  Top 0.254: IC11.6 95.72,39.52 97.47,39.52 97.47,34.28 IC18.11
N$75  (via drill 0.3)
  Top 0.254: IC18.12 v97.31,33.01
  Bottom 0.254: IC15.2 | IC15.2 94.45,39.05 97.47,39.05 97.47,33.01 v97.31,33.01
N$76
  Top 0.254: IC12.2 | IC12.2 103.34,39.05 98.58,39.05 98.58,31.74 IC18.13
N$77  (via drill 0.3)
  Top 0.254: IC18.14 v97.94,30.47
  Bottom 0.254: IC16.6 | IC16.6 102.07,39.52 99.21,39.52 99.21,30.47 v97.94,30.47
N$78
  Top 0.254: IC12.12 | IC12.12 104.61,44.44 103.98,43.81 103.98,38.57 99.05,38.57 99.05,30.47 IC18.3
N$79  (via drill 0.3)
  Top 0.254: IC18.4 | IC18.4 v100.48,31.74
  Bottom 0.254: IC16.10 103.34,44.44 103.98,43.81 103.98,39.05 99.69,39.05 99.69,31.74 v100.48,31.74
N$80
  Top 0.254: IC12.4 | IC12.4 105.88,38.09 99.53,38.09 99.53,33.01 IC18.5
N$81  (via drill 0.3)
  Top 0.254: IC18.6 | IC18.6 v100.48,34.28
  Bottom 0.254: IC16.4 | IC16.4 104.61,38.57 100.48,38.57 v100.48,34.28
N$82
  Top 0.254: 107.15,59.84 R57.2 R17.1 | 107.15,59.84 | 107.15,59.84 107.15,57.14 105.88,55.87 D16.C 105.88,55.24 107.15,53.97 107.15,50.48 105.88,49.21 IC12.11 | IC12.11
N$83
  Bottom 0.254: R18.1 R58.2 108.42,59.84 108.42,57.14 107.15,55.87 D17.C 107.15,55.24 108.42,53.97 108.42,50.48 107.15,49.21 IC16.13 | IC16.13
N$84
  Top 0.254: 109.69,59.84 R59.2 R19.1 | 109.69,59.84 | 109.69,59.84 109.69,57.14 108.42,55.87 D18.C 108.42,55.24 109.69,53.97 109.69,50.48 107.79,48.57 107.79,44.44 107.15,43.81 IC12.5
N$85
  Bottom 0.254: R20.1 R60.2 110.96,59.84 110.96,57.14 109.69,55.87 D19.C 109.69,55.24 110.96,53.97 110.96,50.32 107.79,48.57 107.79,44.44 108.42,43.81 IC16.1
N$86
  Top 0.254: 112.23,59.84 R61.2 R21.1 | 112.23,59.84 | 112.23,59.84 112.23,57.14 110.96,55.87 D20.C 110.96,55.24 112.23,53.97 112.23,50.32 115.25,48.73 115.25,44.44 114.61,43.81 IC13.1
N$87
  Bottom 0.254: R22.1 R62.2 113.5,59.84 113.5,57.14 112.23,55.87 D21.C 112.23,55.24 113.5,53.97 113.5,50.48 115.25,48.73 115.25,44.44 115.88,43.81 IC22.5
N$88
  Top 0.254: 114.77,59.84 R63.2 R23.1 | 114.77,59.84 | 114.77,59.84 114.77,57.14 113.5,55.87 D22.C 113.5,55.24 114.77,53.97 114.77,50.48 115.88,49.37 IC13.13 | IC13.13
N$89
  Bottom 0.254: R24.1 R64.2 116.04,59.84 116.04,57.14 114.77,55.87 D23.C 114.77,55.24 116.04,53.97 116.04,50.48 117.15,49.37 IC22.11
N$90
  Top 0.254: IC12.10 107.15,44.44 106.52,43.81 106.52,37.94 109.21,37.94 109.21,34.28 IC19.11
N$91  (via drill 0.4)
  Top 0.254: IC19.12 v108.74,33.01
  Bottom 0.254: IC16.12 105.88,44.44 105.25,43.81 105.25,38.57 108.74,38.57 v108.74,33.01
N$92
  Top 0.254: IC12.6 | IC12.6 108.42,38.41 109.69,38.41 109.69,31.74 IC19.13
N$93  (via drill 0.3)
  Top 0.254: IC19.14 v109.21,30.47
  Bottom 0.254: IC16.2 | IC16.2 107.15,39.05 109.53,39.05 109.53,30.47 v109.21,30.47
N$94
  Top 0.254: IC13.2 | IC13.2 115.88,38.89 110.64,38.89 110.64,30.47 IC19.3
N$95  (via drill 0.3)
  Top 0.254: v111.91,31.74 IC19.4
  Bottom 0.254: IC22.6 114.61,39.05 111.12,39.05 111.12,31.74 v111.91,31.74
N$96
  Top 0.254: IC13.12 117.15,44.44 116.52,43.81 116.52,38.41 111.12,38.41 111.12,33.01 IC19.5
N$97  (via drill 0.3)
  Top 0.254: v111.91,34.28 IC19.6
  Bottom 0.254: IC22.10 115.88,44.44 116.52,43.81 116.52,38.57 111.91,38.57 v111.91,34.28
N$98
  Top 0.254: 117.31,59.84 R65.2 R25.1 | 117.31,59.84 | 117.31,59.84 117.31,57.14 116.04,55.87 D24.C 116.04,55.24 117.31,53.97 117.31,50.48 117.79,50 117.79,44.44 117.15,43.81 IC13.3
N$99
  Bottom 0.254: R26.1 R66.2 118.58,59.84 118.58,57.14 117.31,55.87 D25.C 117.31,55.24 118.58,53.97 118.58,50.48 119.06,50 119.06,44.44 118.42,43.81 IC22.3
N$100
  Top 0.254: 119.85,59.84 R67.2 R27.1 | 119.85,59.84 | 119.85,59.84 119.85,57.14 118.58,55.87 D26.C 118.58,55.24 119.85,53.97 119.85,50.48 118.42,49.05 IC13.11
N$101
  Bottom 0.254: R28.1 R68.2 121.12,59.84 121.12,57.14 119.85,55.87 D27.C 119.85,55.24 121.12,53.97 121.12,50.48 119.69,49.05 119.69,48.73 | 119.69,48.73 119.69,48.57 | IC22.13 119.69,48.73
N$102
  Top 0.254: 122.39,59.84 R69.2 R29.1 | 122.39,59.84 | 122.39,59.84 122.39,57.14 121.12,55.87 D28.C 121.12,55.24 122.39,53.97 122.39,50.48 120.33,48.41 120.33,44.44 119.69,43.81 IC13.5
N$103
  Bottom 0.254: R30.1 R70.2 123.66,59.84 123.66,57.14 122.39,55.87 D29.C 122.39,55.24 123.66,53.97 123.66,50.32 120.33,48.41 120.33,44.44 120.96,43.81 IC22.1
N$104
  Top 0.254: 124.93,59.84 R71.2 R31.1 | 124.93,59.84 | 124.93,59.84 124.93,57.14 123.66,55.87 D30.C 123.66,55.24 124.93,53.97 124.93,50.32 128.11,48.57 128.11,44.44 127.47,43.81 IC14.1
N$105
  Bottom 0.254: R32.1 R72.2 126.2,59.84 126.2,57.14 124.93,55.87 D31.C 124.93,55.24 126.2,53.97 126.2,50.48 128.11,48.57 128.11,44.44 128.74,43.81 IC23.5 | IC23.5
N$106
  Top 0.254: IC13.4 118.42,37.94 120.49,37.94 120.49,34.28 IC20.11
N$107  (via drill 0.3)
  Top 0.254: IC20.12 v120.17,33.01
  Bottom 0.254: IC22.4 117.15,38.57 120.17,38.57 v120.17,33.01 | v120.17,33.01
N$108
  Top 0.254: IC13.10 | 119.69,44.44 IC13.10 | 119.69,44.44 | 119.69,44.44 119.22,43.97 119.06,43.81 119.06,38.41 120.96,38.41 120.96,31.74 IC20.13
N$109  (via drill 0.3)
  Top 0.254: IC20.14 v120.8,30.47
  Bottom 0.254: IC22.12 118.42,44.44 117.95,43.97 117.79,43.81 117.79,39.05 120.96,39.05 120.96,30.47 v120.8,30.47
N$110
  Top 0.254: IC13.6 | IC13.6 120.96,39.52 121.91,39.52 121.91,30.47 IC20.3
N$111  (via drill 0.3)
  Top 0.254: v123.34,31.74 IC20.4
  Bottom 0.254: IC22.2 119.69,39.52 121.44,39.52 121.44,31.74 v123.34,31.74
N$112
  Top 0.254: IC14.2 128.74,38.89 122.39,38.89 122.39,33.01 IC20.5
N$113  (via drill 0.3)
  Top 0.254: IC20.6 v123.34,34.28
  Bottom 0.254: IC23.6 | IC23.6 127.47,38.57 123.34,38.57 v123.34,34.28
N$114
  Top 0.254: 127.47,59.84 R73.2 R33.1 | 127.47,59.84 | 127.47,59.84 127.47,57.14 126.2,55.87 D32.C 126.2,55.24 127.47,53.97 127.47,50.48 128.74,49.21 128.74,48.89 | 128.74,48.89 128.74,48.73 | IC14.13 128.74,48.89
N$115
  Bottom 0.254: R34.1 R74.2 128.74,59.84 128.74,57.14 127.47,55.87 D33.C 127.47,55.24 128.74,53.97 128.74,50.48 130.01,49.21 IC23.11 | IC23.11
N$116
  Top 0.254: 130.01,59.84 R75.2 R35.1 | 130.01,59.84 | 130.01,59.84 130.01,57.14 128.74,55.87 D34.C 128.74,55.24 130.01,53.97 130.01,50.48 130.65,49.84 130.65,44.44 130.01,43.81 IC14.3
N$117
  Bottom 0.254: R36.1 R76.2 131.28,59.84 131.28,57.14 130.01,55.87 D35.C 130.01,55.24 131.28,53.97 131.28,50.48 131.92,49.84 131.92,44.44 131.28,43.81 IC23.3
N$118
  Top 0.254: 132.55,59.84 R77.2 R37.1 | 132.55,59.84 | 132.55,59.84 132.55,57.14 131.28,55.87 D36.C 131.28,55.24 132.55,53.97 132.55,50.48 131.28,49.21 IC14.11
N$119
  Bottom 0.254: R38.1 R78.2 133.82,59.84 133.82,57.14 132.55,55.87 D37.C 132.55,55.24 133.82,53.97 133.82,50.48 132.55,49.21 IC23.13 | IC23.13
N$120
  Top 0.254: 135.09,59.84 R79.2 R39.1 | 135.09,59.84 | 135.09,59.84 135.09,57.14 133.82,55.87 D38.C 133.82,55.24 135.09,53.97 135.09,50.48 133.19,48.57 133.19,44.44 132.55,43.81 IC14.5
N$121
  Bottom 0.254: R40.1 R80.2 136.36,59.84 136.36,57.14 135.09,55.87 D39.C 135.09,55.24 136.36,53.97 136.36,50.32 133.19,48.57 133.19,44.44 133.82,43.81 IC23.1
N$122
  Top 0.254: IC14.12 130.01,44.44 129.38,43.81 129.38,37.94 131.92,37.94 131.92,34.28 IC21.11
N$123  (via drill 0.3)
  Top 0.254: v131.6,33.01 131.44,33.01 IC21.12
  Bottom 0.254: IC23.10 128.74,44.44 129.38,43.81 129.38,37.78 131.6,37.78 v131.6,33.01
N$124
  Top 0.254: IC14.4 131.28,38.89 132.87,38.89 132.87,31.74 IC21.13
N$125  (via drill 0.3)
  Top 0.254: IC21.14 v132.23,30.47
  Bottom 0.254: IC23.4 | IC23.4 130.01,38.25 132.39,38.25 132.39,30.47 v132.23,30.47
N$126
  Top 0.254: IC14.10 132.55,44.44 131.92,43.81 131.92,39.36 133.34,39.36 133.34,30.47 IC21.3
N$127  (via drill 0.3)
  Top 0.254: v134.77,31.74 IC21.4
  Bottom 0.254: IC23.12 131.28,44.44 130.65,43.81 130.65,38.73 132.87,38.73 132.87,31.74 v134.77,31.74
N$128
  Top 0.254: 133.82,39.52 IC14.6 | IC21.5 133.82,33.01 133.82,39.52 | 133.82,39.52
N$129  (via drill 0.3)
  Top 0.254: v134.77,34.28 IC21.6
  Bottom 0.254: IC23.2 | IC23.2 132.55,39.2 133.34,39.2 133.34,34.28 v134.77,34.28
N$130  (via drill 0.3)
  Top 0.254: IC18.10 v92.55,35.55 93.82,35.55 | IC17.9 | v83.34,36.82 IC17.9
  Bottom 0.254: v92.55,35.55 92.55,26.98 83.34,26.98 v83.34,36.82
N$131  (via drill 0.3)
  Top 0.254: IC18.9 94.29,36.82 v93.34,36.82 | v103.98,35.55 IC19.10
  Bottom 0.254: v103.98,35.55 103.98,26.98 93.34,26.98 v93.34,36.82
N$132  (via drill 0.3)
  Top 0.254: v104.77,36.82 IC19.9 | v116.36,35.55 IC20.10
  Bottom 0.254: v116.36,35.55 116.36,26.98 104.77,26.98 v104.77,36.82
N$133  (via drill 0.3)
  Top 0.254: v117.15,36.82 IC20.9 | v127.79,35.55 IC21.10
  Bottom 0.254: v127.79,35.55 127.79,26.98 117.15,26.98 v117.15,36.82
N$134
  Top 0.254: OK2.4 | R84.2 OK2.4
N$136
  Top 0.254: Q1.B 43.81,26.82 50.64,26.82 R95.2 | R95.2 | R95.2
N$137
  Top 0.254: OK5.6 R92.1 | OK5.6
  Bottom 0.254: R92.1 | OK5.6 | R92.1 OK5.6
N$142
  Top 0.254: OK4.3 | R89.1 OK4.3
N$144
  Top 0.254: R93.2 OK5.2 | OK5.2
OE_OUT  (via drill 0.3)
  Top 0.254: v40.64,26.82 40.95,26.5 40.95,24.12 Q1.C
  Bottom 0.254: IC5.10 55.08,41.9 53.81,43.17 48.73,43.17 47.46,41.9 IC4.10 42.38,41.9 41.11,43.17 36.03,43.17 34.76,41.9 IC3.10 29.68,41.9 28.41,43.17 23.33,43.17 22.06,41.9 IC2.10 16.98,41.9 15.71,43.17 10.63,43.17 9.36,41.9 IC1.10 1.74,41.9 1.74,26.82 v40.64,26.82 | IC5.10 | R94.2 IC5.10
OE_OUTI
  Top 0.254: SV2.4 30.32,5.23 30.32,8.73 48.1,8.73 R93.1 | R93.1
OUT1
  Bottom 0.254: IC1.20 | X1.1 13.33,73.5 13.81,73.5 IC1.20
OUT2
  Bottom 0.254: IC1.19 15.39,62.22 15.39,73.5 16.03,73.5 16.03,74.25 X1.2
OUT3
  Bottom 0.254: IC1.18 15.87,59.68 15.87,73.02 18.89,73.02 18.89,74.24 X1.3
OUT4
  Bottom 0.254: IC1.17 16.35,57.14 16.35,72.54 21.58,72.54 21.58,74.27 X1.4
OUT5
  Bottom 0.254: IC1.16 15.71,54.6 16.98,55.87 20.47,55.87 20.47,72.07 24.28,72.07 24.28,74.22 X1.5
OUT6
  Bottom 0.254: IC1.15 15.71,52.06 16.98,53.33 20.95,53.33 20.95,71.59 27.14,71.59 27.14,74.26 X1.6
OUT7
  Bottom 0.254: IC1.14 15.71,49.52 16.98,50.79 21.43,50.79 21.43,71.11 29.84,71.11 29.84,74.24 X1.7
OUT8
  Bottom 0.254: IC1.13 15.71,46.98 16.98,48.25 21.9,48.25 21.9,70.64 32.54,70.64 32.54,74.2 X1.8
OUT9
  Bottom 0.254: IC2.20 26.51,70.16 35.4,70.16 X1.9
OUT10
  Bottom 0.254: IC2.19 28.09,62.22 28.09,69.69 38.1,69.69 38.1,74.22 X1.10
OUT11
  Bottom 0.254: IC2.18 28.57,59.68 28.57,69.21 40.95,69.21 40.95,74.24 X1.11
OUT12
  Bottom 0.254: IC2.17 29.05,57.14 29.05,68.73 43.65,68.73 43.65,74.26 X1.12
OUT13
  Bottom 0.254: IC2.16 28.41,54.6 29.68,55.87 33.17,55.87 33.17,68.26 46.51,68.26 46.51,74.22 X1.13
OUT14
  Bottom 0.254: IC2.15 28.41,52.06 29.68,53.33 33.65,53.33 33.65,67.78 49.21,67.78 49.21,74.27 X1.14
OUT15
  Bottom 0.254: IC2.14 28.41,49.52 29.68,50.79 34.13,50.79 34.13,67.3 51.91,67.3 51.91,74.24 X1.15
OUT16
  Bottom 0.254: IC2.13 28.41,46.98 29.68,48.25 34.6,48.25 34.6,66.83 54.76,66.83 54.76,74.25 X1.16
OUT17
  Bottom 0.254: X1.17 57.46,66.35 39.21,66.35 IC3.20
OUT18
  Top 0.254: X1.18 14.76,76.77 14.76,65.88 40.79,65.88 40.79,62.22 IC3.19
OUT19
  Top 0.254: X1.19 17.46,76.81 17.46,66.35 41.27,66.35 41.27,59.68 IC3.18
OUT20
  Top 0.254: X1.20 20.31,76.72 20.31,66.83 41.75,66.83 41.75,57.14 IC3.17
OUT21  (via drill 0.3)
  Top 0.254: X1.21 23.01,76.79 23.01,67.3 46.35,67.3 v46.35,63.49
  Bottom 0.254: IC3.16 41.11,54.6 42.38,55.87 46.35,55.87 v46.35,63.49
OUT22  (via drill 0.3)
  Top 0.254: X1.22 25.71,67.78 47.46,67.78 v47.46,63.49
  Bottom 0.254: IC3.15 41.11,52.06 42.38,53.33 47.46,53.33 v47.46,63.49
OUT23  (via drill 0.3)
  Top 0.254: X1.23 28.57,76.75 28.57,68.26 48.57,68.26 v48.57,63.49
  Bottom 0.254: IC3.14 41.11,49.52 42.38,50.79 48.57,50.79 v48.57,63.49
OUT24  (via drill 0.3)
  Top 0.254: X1.24 31.27,76.82 31.27,68.73 49.68,68.73 v49.68,63.49
  Bottom 0.254: IC3.13 41.11,46.98 42.38,48.25 49.68,48.25 v49.68,63.49
OUT25
  Top 0.254: X1.25 33.97,76.8 33.97,69.21 51.91,69.21 IC4.20
OUT26
  Top 0.254: X1.26 36.83,76.77 36.83,69.69 53.49,69.69 53.49,62.22 IC4.19 | IC4.19
OUT27
  Top 0.254: X1.27 39.52,76.82 39.52,70.16 53.97,70.16 53.97,59.68 IC4.18
OUT28
  Top 0.254: X1.28 42.22,76.77 42.22,70.64 54.45,70.64 54.45,57.14 IC4.17
OUT29  (via drill 0.3)
  Top 0.254: X1.29 45.08,76.8 45.08,71.11 59.05,71.11 v59.05,63.49
  Bottom 0.254: IC4.16 53.81,54.6 55.08,55.87 59.05,55.87 v59.05,63.49
OUT30  (via drill 0.3)
  Top 0.254: X1.30 47.78,76.79 47.78,71.59 60.16,71.59 v60.16,63.49
  Bottom 0.254: IC4.15 53.81,52.06 55.08,53.33 60.16,53.33 v60.16,63.49
OUT31  (via drill 0.3)
  Top 0.254: X1.31 50.64,76.78 50.64,72.07 61.27,72.07 v61.27,63.49
  Bottom 0.254: IC4.14 53.81,49.52 55.08,50.79 61.27,50.79 v61.27,63.49
OUT32  (via drill 0.3)
  Top 0.254: X1.32 53.34,72.54 62.38,72.54 v62.38,63.49
  Bottom 0.254: IC4.13 53.81,46.98 55.08,48.25 62.38,48.25 v62.38,63.49
OUT33
  Top 0.254: X1.33 56.03,76.77 56.03,73.02 64.61,73.02 IC5.20
OUT34
  Bottom 0.254: IC5.19 66.19,62.22 66.19,70.16 59.05,70.16 59.05,81.59 13.33,81.59 X1.34
OUT35  (via drill 0.3)
  Top 0.254: X1.35 16.19,79.49 v16.19,82.39
  Bottom 0.254: IC5.18 66.67,59.68 66.67,70.64 59.53,70.64 59.53,82.39 v16.19,82.39
OUT36  (via drill 0.3)
  Top 0.254: X1.36 18.73,79.48 v18.73,83.18
  Bottom 0.254: IC5.17 67.15,57.14 67.15,71.11 60,71.11 60,83.18 v18.73,83.18
OUT37  (via drill 0.3)
  Top 0.254: X1.37 21.58,79.37 v21.58,83.97
  Bottom 0.254: IC5.16 67.62,54.6 67.62,71.59 60.48,71.59 60.48,83.97 v21.58,83.97
OUT38  (via drill 0.3)
  Top 0.254: X1.38 24.28,79.37 v24.28,84.77
  Bottom 0.254: IC5.15 68.1,52.06 68.1,72.07 60.96,72.07 60.96,84.77 v24.28,84.77
OUT39  (via drill 0.3)
  Top 0.254: X1.39 27.14,79.37 v27.14,85.56
  Bottom 0.254: IC5.14 68.57,49.52 68.57,72.54 61.43,72.54 61.43,85.56 v27.14,85.56
OUT40  (via drill 0.3)
  Top 0.254: X1.40 29.84,79.37 v29.84,86.35
  Bottom 0.254: IC5.13 69.05,46.98 69.05,73.02 61.91,73.02 61.91,86.35 v29.84,86.35
SCLK  (via drill 0.3)
  Top 0.254: IC20.2 124.93,29.2 | IC20.2 120.8,29.2 120.17,29.84 115.72,29.84 115.09,29.2 IC19.2 109.37,29.2 108.74,29.84 104.29,29.84 103.66,29.2 IC18.2 101.91,29.2 97.94,29.2 97.31,29.84 92.86,29.84 92.23,29.2 IC17.2 86.51,29.2 85.88,29.84 v82.07,29.84 | IC20.2 125.72,29.2 126.36,29.84 131.6,29.84 132.23,29.2 IC21.2 v138.11,29.2 | v6.66,33.17 IC6.11 | v57.46,33.17 57.46,30.16 IC10.11 57.46,26.82 63.18,26.82 JP1.3 | v44.76,33.17 IC9.11 | v32.06,33.17 IC8.11 | v19.36,33.17 IC7.11 19.36,27.46 14.44,27.46 14.44,23.17 | R81.1 14.44,23.17 | R81.1 OK2.7 | R81.1 | 14.44,23.17
  Bottom 0.254: v6.66,33.17 v19.36,33.17 v32.06,33.17 v44.76,33.17 v57.46,33.17 82.07,33.17 v82.07,29.84 | v138.11,29.2 JP2.3
SCLKI
  Top 0.254: R83.1 13.17,8.57 22.7,8.57 22.7,5.23 SV2.8 | SV2.8
SI_IN  (via drill 0.3)
  Top 0.254: v128.58,36.82 IC21.9 | v56.03,20.79 59.37,20.79 JP1.5 | JP1.5 | R86.2 v25.24,25.07 v25.24,25.08
  Bottom 0.254: 128.58,25.23 v128.58,36.82 | 128.58,25.23 135.57,25.23 JP2.5 | JP1.5 | 128.58,25.23 60.64,25.23 JP1.5 | v56.03,20.79 55.24,20 25.24,20 v25.24,25.08
SI_INI
  Top 0.254: OK3.6 | OK3.6 | OK3.6 | OK3.6 | SV2.5 | SV2.5 OK3.6
  Bottom 0.254: OK3.6 | OK3.6 | OK3.6 R88.1 | OK3.6
SI_OUT
  Top 0.254: IC10.9 54.92,27.46 31.59,27.46 R85.2
SI_OUTI
  Top 0.254: OK3.7 | OK3.7 | OK3.7 | SV2.6 | SV2.6 27.78,5.23 27.78,9.68 29.05,9.68 OK3.7 | OK3.7 | OK3.7
  Bottom 0.254: OK3.7 | OK3.7 | OK3.7 R87.1 | OK3.7
SO_IN  (via drill 0.3)
  Top 0.254: IC17.10 | IC17.10 81.27,35.55 v81.27,24.6 | OK1.6 | OK1.6 | OK1.6 R2.1
  Bottom 0.254: JP2.6 134.46,20.63 134.46,24.6 v81.27,24.6 61.91,24.6 61.91,20.79 JP1.6 | JP1.6 | JP1.6 59.37,20.79 57.15,20.79 55.88,19.52 7.46,19.52 OK1.6
SO_INI
  Top 0.254: R4.1 10,8.09 21.43,8.09 SV2.9 | SV2.9
SO_OUT
  Top 0.254: IC6.14 10.47,27.46 3.65,27.46 3.65,23.17 | OK1.7 | OK1.7 R1.1 3.65,23.17 | 3.65,23.17 | OK1.7 | OK1.7
SO_OUTI
  Top 0.254: R3.1 2.38,7.61 20.16,7.61 20.16,5.23 SV2.10 | SV2.10
SSYNC  (via drill 0.3)
  Top 0.254: IC10.12 | v58.73,33.81 IC10.12 | IC6.12 v7.93,33.81 | v20.63,33.81 IC7.12 20.63,26.98 19.52,26.98 19.52,23.17 R82.1 OK2.6 | v33.33,33.81 IC8.12 | v46.03,33.81 IC9.12 | OK2.6 | v82.7,28.57 85.88,28.57 86.51,27.93 IC17.1 92.23,27.93 92.86,28.57 97.31,28.57 97.94,27.93 101.91,27.93 IC18.1 103.66,27.93 104.29,28.57 108.74,28.57 109.37,27.93 IC19.1 115.09,27.93 115.72,28.57 120.17,28.57 120.8,27.93 IC20.1 125.72,27.93 126.36,28.57 131.6,28.57 132.23,27.93 IC21.1 136.84,27.93 v136.84,27.14 | IC10.12 58.73,27.3 64.45,27.3 64.45,20.79 JP1.4
  Bottom 0.254: v7.93,33.81 v20.63,33.81 v33.33,33.81 v46.03,33.81 v58.73,33.81 82.7,33.81 v82.7,28.57 | JP2.4 136.84,20.79 v136.84,27.14
SSYNCI
  Top 0.254: R84.1 20.79,9.04 23.97,9.04 SV2.7 | SV2.7